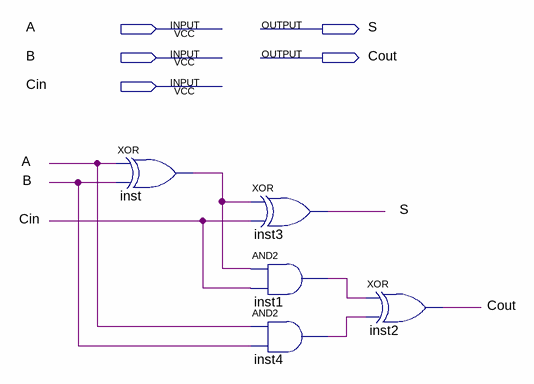
[diagram p0: schematic sheet]
// Quartus schematic gA6_adder.bdf as structural Verilog: 5 symbols, 5 pins
module gA6_adder (
  input  A,
  input  B,
  input  Cin,
  output S,
  output Cout
);

  wire inst1_out, inst4_out, inst_out;

  xor inst (inst_out, A, B);
  xor inst3 (S, inst_out, Cin);
  and inst1 (inst1_out, inst_out, Cin);
  and inst4 (inst4_out, A, B);
  xor inst2 (Cout, inst1_out, inst4_out);
endmodule
